# Altium schematic sheet Voltage_Level_Translator_v3.SchDoc
size A4; Author: Luis Sanchez; ProjectName: PCB shield project
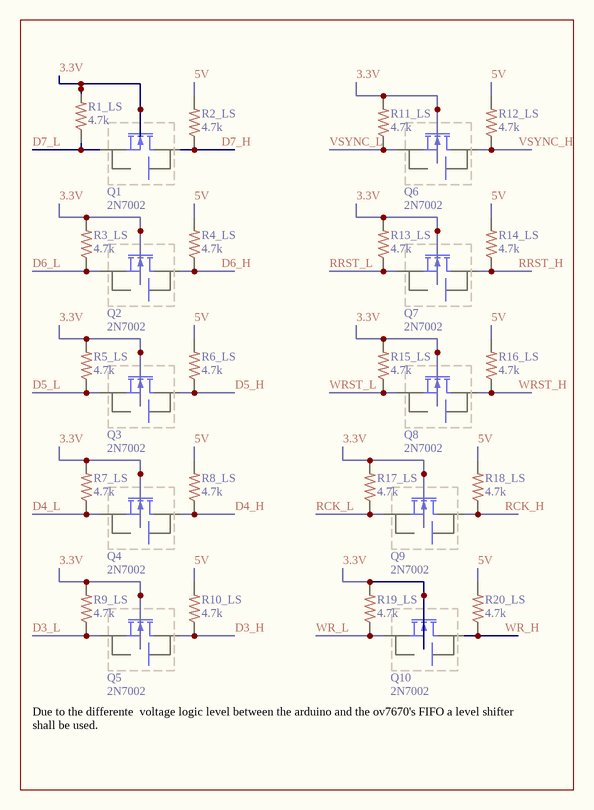
[diagram p0: Voltage_Level_Translator_v3.SchDoc]

## Parts
Q1  2N7002  [SOT-23]
Q2  2N7002  [SOT-23]
Q3  2N7002  [SOT-23]
Q4  2N7002  [SOT-23]
Q5  2N7002  [SOT-23]
Q6  2N7002  [SOT-23]
Q7  2N7002  [SOT-23]
Q8  2N7002  [SOT-23]
Q9  2N7002  [SOT-23]
Q10  2N7002  [SOT-23]
R1_LS  4.7k  [0805]
R2_LS  4.7k  [0805]
R3_LS  4.7k  [0805]
R4_LS  4.7k  [0805]
R5_LS  4.7k  [0805]
R6_LS  4.7k  [0805]
R7_LS  4.7k  [0805]
R8_LS  4.7k  [0805]
R9_LS  4.7k  [0805]
R10_LS  4.7k  [0805]
R11_LS  4.7k  [0805]
R12_LS  4.7k  [0805]
R13_LS  4.7k  [0805]
R14_LS  4.7k  [0805]
R15_LS  4.7k  [0805]
R16_LS  4.7k  [0805]
R17_LS  4.7k  [0805]
R18_LS  4.7k  [0805]
R19_LS  4.7k  [0805]
R20_LS  4.7k  [0805]

## Nets
3.3V: Q1.2(G) Q2.2(G) Q3.2(G) Q4.2(G) Q5.2(G) Q6.2(G) Q7.2(G) Q8.2(G) Q9.2(G) Q10.2(G) R1_LS.2 R3_LS.2 R5_LS.2 R7_LS.2 R9_LS.2 R11_LS.2 R13_LS.2 R15_LS.2 R17_LS.2 R19_LS.2
5V: R2_LS.2 R4_LS.2 R6_LS.2 R8_LS.2 R10_LS.2 R12_LS.2 R14_LS.2 R16_LS.2 R18_LS.2 R20_LS.2
D3_H: Q5.1(D) R10_LS.1
D3_L: Q5.3(S) R9_LS.1
D4_H: Q4.1(D) R8_LS.1
D4_L: Q4.3(S) R7_LS.1
D5_H: Q3.1(D) R6_LS.1
D5_L: Q3.3(S) R5_LS.1
D6_H: Q2.1(D) R4_LS.1
D6_L: Q2.3(S) R3_LS.1
D7_H: Q1.1(D) R2_LS.1
D7_L: Q1.3(S) R1_LS.1
RCK_H: Q9.1(D) R18_LS.1
RCK_L: Q9.3(S) R17_LS.1
RRST_H: Q7.1(D) R14_LS.1
RRST_L: Q7.3(S) R13_LS.1
VSYNC_H: Q6.1(D) R12_LS.1
VSYNC_L: Q6.3(S) R11_LS.1
WR_H: Q10.1(D) R20_LS.1
WR_L: Q10.3(S) R19_LS.1
WRST_H: Q8.1(D) R16_LS.1
WRST_L: Q8.3(S) R15_LS.1

## Notes on the sheet
- Due to the differente  voltage logic level between the arduino and the ov7670's FIFO a level shifter shall be used.
- Designer's signature
- Sheet title:
- Dpto. Electrónica y Tecnología
- de Computadores
- Supervisor's signature
- Project title:
- Desginer:
- University of Granada
- C/ Fuente Nueva, s/n, 18001
- Granada, Granada, Spain
- Sr. Andrés Roldán Aranda
- Date:
- Revision:
- Sheet
- of

## Library data of the parts
Q1-Q10 = MOSFET-N_MOD: N-Channel MOSFET; Published: 8-Jun-2000; LatestRevisionDate: 17-Jul-2002; LatestRevisionNote: Re-released for DXP Platform.; PackageVersion: 1995/1996; PackageReference: E3; Publisher: Altium Limited; PackageDescription: TO, Flat Index; 3 In-Line, Axial Leads; Body Dia. 4.6mm; Lead Dia. 0.5 mm (max)
R1_LS R2_LS R3_LS R4_LS R5_LS R6_LS R7_LS R8_LS R9_LS R10_LS R11_LS R12_LS R13_LS R14_LS R15_LS R16_LS R17_LS R18_LS R19_LS R20_LS = 0805RESISTOR: Supplier 1: Digi-Key